# EAGLE design AS5040_Motor (EAGLE 6.3)
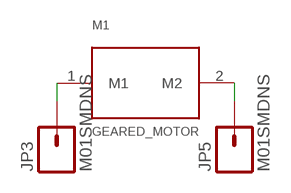
[diagram p0: schematic, sheet 1]

## Parts
JP3  M01SMDNS  [1X01NS]
JP5  M01SMDNS  [1X01NS]
M1  GEARED_MOTOR  [GEARED_MOTOR]

## Nets
N$3: JP5.1 M1.2(M2)
N$4: JP3.1 M1.1(M1)

## Library data of the parts
JP3 JP5 = SparkFun-Connectors:M01: Header 1 Standard 1-pin 0.1" header. Use with straight break away headers (SKU : PRT-00116), right angle break away headers (PRT-00553), swiss pins (PRT-00743), machine pins (PRT-00117), and female headers (PRT-00115).
M1 = geared-motor:GEARED_MOTOR

## Board
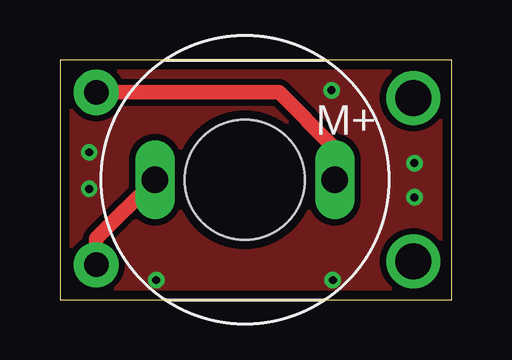
[diagram p1: board, top side]
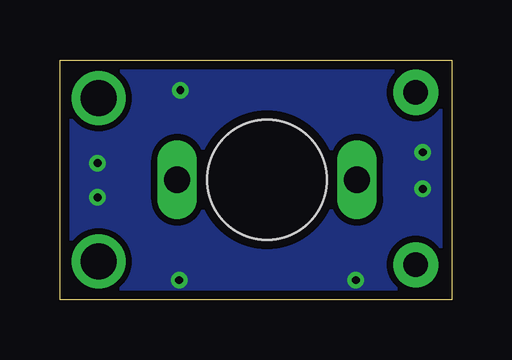
[diagram p2: board, bottom side, seen from below]

Size 16.35 x 10 mm. Coordinates in mm from the lower left corner, seen from the top.
Outline: 0,0 16.35,0 16.35,10 0,10 0,0
Copper layers (1*16): Top 0.0356mm / dielectric 1.5011mm / Bottom 0.0356mm
Design rules "LaenPCBOrder *": minimum track width 6mil, minimum drill 13mil, track to track 6mil, track to pad 6mil, pad to pad 6mil, via to via 6mil, smd to smd 6mil, copper to edge 15mil, drill to drill 6mil, minimum pad ring 7mil, minimum via ring 7mil, stop-mask expansion 4mil, vias tented up to drill 13mil, thermal gap 10mil

### Footprints (pad centres in the part's own frame; a part is rotated, then mirrored left to right if it is on the bottom)
1X01NS = drill 1.016 pad 1.88: 1 0,0
GEARED_MOTOR = drill 1.1 long: 1 -3.75,0; 2 3.75,0 | hole 5: 0,0

### Placement (x,y rotation side)
JP3  1.51,1.45 0 top
JP5  1.51,8.65 0 top
M1  7.71,5 0 top

### Tracks (layer width: path | path; a pad name or v marks a point on that pad's centre or on a via)
GND  (via drill 0.33)
  other vias: 14.78,5.69 14.78,4.27 11.38,0.81 4.01,0.81 11.33,8.74 1.22,6.15 1.22,4.62
  pour Bottom (isolate 0.254, no thermals): 0,0 0,9.96 16.41,9.96 16.41,0
  pour Top (isolate 0.254): 0,0 0,9.96 16.41,9.96 16.41,0
N$1  (via drill 1.5)
  other vias: 14.73,8.4
N$2  (via drill 1.5)
  other vias: 14.73,1.6
N$3
  Top 0.61: JP5.1 9.13,8.65 11.43,6.35 11.43,5.03 M1.2
N$4
  Top 0.61: JP3.1 1.51,2.55 M1.1

### Text on the board
tNames: M+